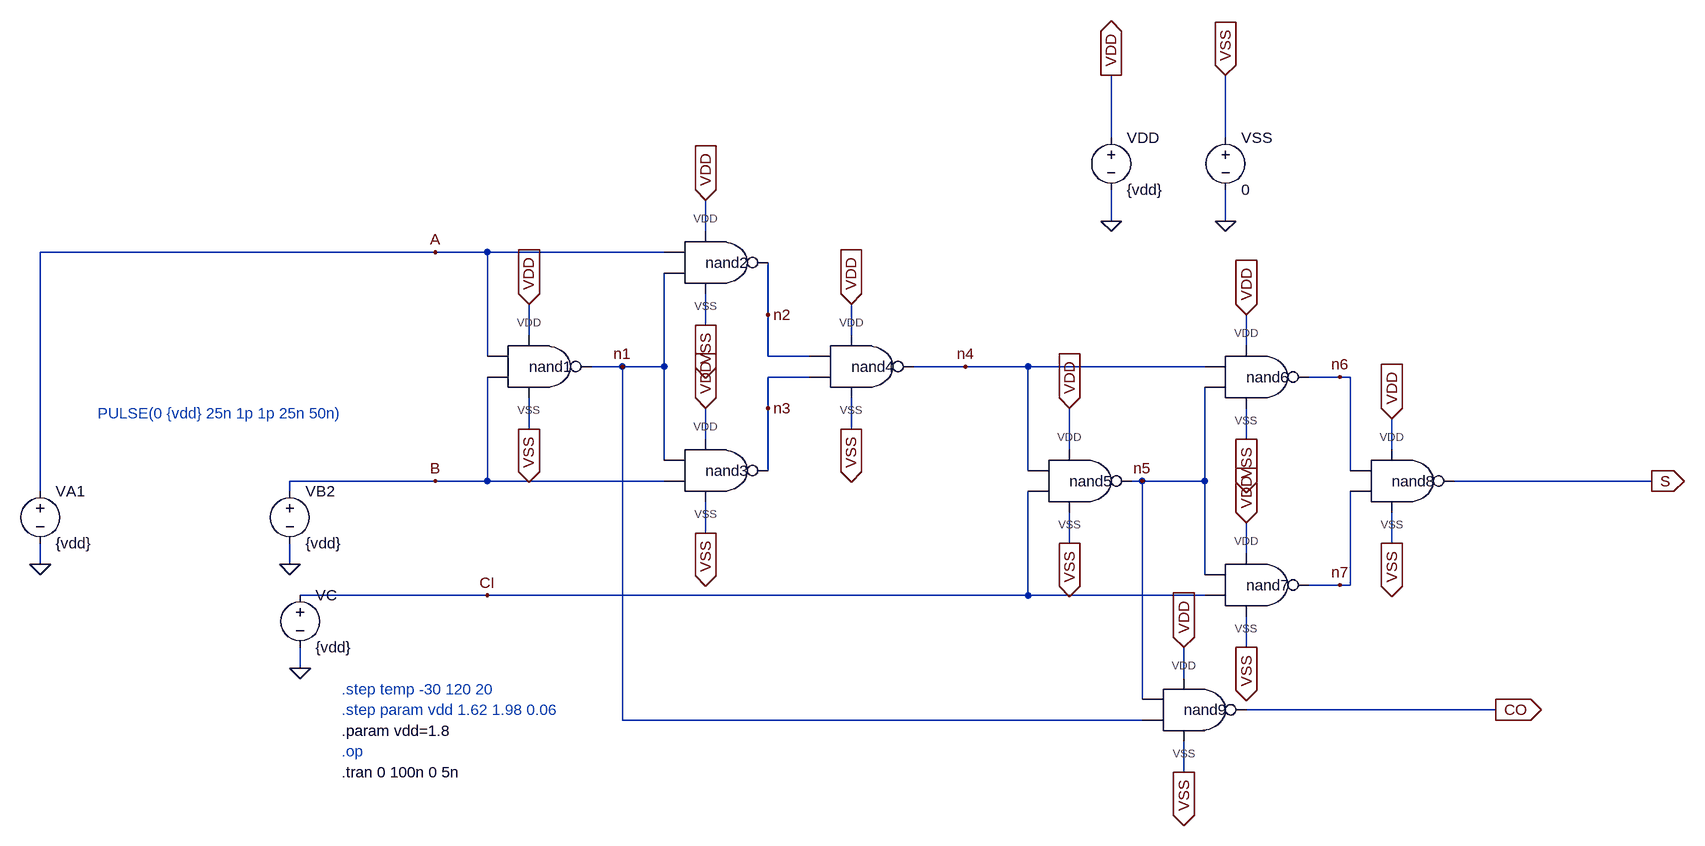
[diagram p0: schematic sumator.asc]
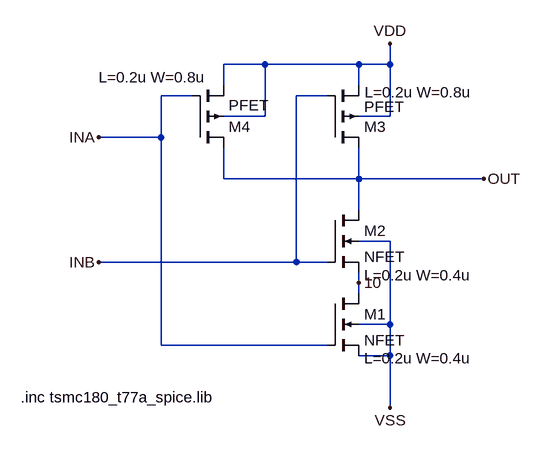
[diagram p1: sub-circuit nand.asc]
sumator.asc, the LTspice schematic file:
Version 4
SHEET 1 1644 808
WIRE 656 -272 656 -368
WIRE 832 -272 832 -368
WIRE 656 -144 656 -192
WIRE 832 -144 832 -192
WIRE 32 -128 32 -176
WIRE -384 -96 -992 -96
WIRE -304 -96 -384 -96
WIRE -32 -96 -304 -96
WIRE 128 0 128 -80
WIRE 32 16 32 -32
WIRE -240 32 -240 -16
WIRE 256 32 256 -16
WIRE 864 48 864 0
WIRE -304 64 -304 -96
WIRE 128 64 128 0
WIRE 192 64 128 64
WIRE -96 80 -144 80
WIRE -32 80 -32 -64
WIRE -32 80 -96 80
WIRE 432 80 352 80
WIRE 528 80 432 80
WIRE 800 80 528 80
WIRE 192 96 128 96
WIRE 1008 96 960 96
WIRE 1024 96 1008 96
WIRE 128 144 128 96
WIRE -240 176 -240 128
WIRE 256 176 256 128
WIRE 32 192 32 144
WIRE 864 192 864 144
WIRE 592 208 592 144
WIRE 1088 208 1088 160
WIRE -32 224 -32 80
WIRE 128 240 128 144
WIRE 528 240 528 80
WIRE 1024 240 1024 96
WIRE -384 256 -608 256
WIRE -304 256 -304 96
WIRE -304 256 -384 256
WIRE -32 256 -304 256
WIRE 704 256 688 256
WIRE 800 256 800 112
WIRE 800 256 704 256
WIRE 1488 256 1184 256
WIRE -992 272 -992 -96
WIRE -608 272 -608 256
WIRE 32 336 32 288
WIRE 592 352 592 304
WIRE 1088 352 1088 304
WIRE 864 368 864 320
WIRE -992 384 -992 352
WIRE -608 384 -608 352
WIRE 800 400 800 256
WIRE 1008 416 960 416
WIRE 1024 416 1024 272
WIRE 1024 416 1008 416
WIRE -304 432 -592 432
WIRE 528 432 528 272
WIRE 528 432 -304 432
WIRE 800 432 528 432
WIRE 864 512 864 464
WIRE -592 544 -592 512
WIRE 768 560 768 512
WIRE 704 592 704 256
WIRE 1248 608 864 608
WIRE -96 624 -96 80
WIRE 704 624 -96 624
WIRE 768 704 768 656
FLAG 1488 256 S
IOPIN 1488 256 Out
FLAG -608 384 0
FLAG -992 384 0
FLAG 656 -368 VDD
IOPIN 656 -368 Out
FLAG 32 -176 VDD
IOPIN 32 -176 In
FLAG 32 144 VDD
IOPIN 32 144 In
FLAG -240 -16 VDD
IOPIN -240 -16 In
FLAG 256 -16 VDD
IOPIN 256 -16 In
FLAG 592 144 VDD
IOPIN 592 144 In
FLAG 864 320 VDD
IOPIN 864 320 In
FLAG 1088 160 VDD
IOPIN 1088 160 In
FLAG 864 0 VDD
IOPIN 864 0 In
FLAG 768 512 VDD
IOPIN 768 512 In
FLAG 656 -144 0
FLAG -592 544 0
FLAG 1248 608 CO
IOPIN 1248 608 Out
FLAG -384 -96 A
FLAG -384 256 B
FLAG -304 432 CI
FLAG -96 80 n1
FLAG 128 0 n2
FLAG 128 144 n3
FLAG 432 80 n4
FLAG 704 256 n5
FLAG 1008 96 n6
FLAG 1008 416 n7
FLAG 832 -144 0
FLAG 832 -368 VSS
IOPIN 832 -368 In
FLAG 32 16 VSS
IOPIN 32 16 Out
FLAG -240 176 VSS
IOPIN -240 176 Out
FLAG 32 336 VSS
IOPIN 32 336 Out
FLAG 256 176 VSS
IOPIN 256 176 Out
FLAG 592 352 VSS
IOPIN 592 352 Out
FLAG 864 192 VSS
IOPIN 864 192 Out
FLAG 864 512 VSS
IOPIN 864 512 Out
FLAG 768 704 VSS
IOPIN 768 704 Out
FLAG 1088 352 VSS
IOPIN 1088 352 Out
SYMBOL NAND -240 80 R0
WINDOW 0 0 0 Left 2
SYMATTR InstName nand1
SYMBOL voltage 656 -288 R0
SYMATTR InstName VDD
SYMATTR Value {vdd}
SYMBOL voltage -608 256 R0
WINDOW 123 0 0 Left 0
WINDOW 39 0 0 Left 0
SYMATTR InstName VB2
SYMATTR Value {vdd}
SYMBOL voltage -992 256 R0
WINDOW 123 0 0 Left 0
WINDOW 39 0 0 Left 0
SYMATTR InstName VA1
SYMATTR Value {vdd}
SYMBOL NAND 32 -80 R0
WINDOW 0 0 0 Left 2
SYMATTR InstName nand2
SYMBOL NAND 32 240 R0
WINDOW 0 0 0 Left 2
SYMATTR InstName nand3
SYMBOL NAND 256 80 R0
WINDOW 0 0 0 Left 2
SYMATTR InstName nand4
SYMBOL NAND 592 256 R0
WINDOW 0 0 0 Left 2
SYMATTR InstName nand5
SYMBOL NAND 864 96 R0
WINDOW 0 0 0 Left 2
SYMATTR InstName nand6
SYMBOL NAND 864 416 R0
WINDOW 0 0 0 Left 2
SYMATTR InstName nand7
SYMBOL NAND 1088 256 R0
WINDOW 0 0 0 Left 2
SYMATTR InstName nand8
SYMBOL NAND 768 608 R0
WINDOW 0 0 0 Left 2
SYMATTR InstName nand9
SYMBOL voltage -592 416 R0
WINDOW 123 0 0 Left 0
WINDOW 39 0 0 Left 0
SYMATTR InstName VC
SYMATTR Value {vdd}
SYMBOL voltage 832 -288 R0
WINDOW 123 0 0 Left 0
WINDOW 39 0 0 Left 0
SYMATTR InstName VSS
SYMATTR Value 0
TEXT -528 672 Left 2 ;.op
TEXT -528 704 Left 2 !.tran 0 100n 0 5n
TEXT -528 640 Left 2 !.param vdd=1.8
TEXT -528 608 Left 2 ;.step param vdd 1.62 1.98 0.06
TEXT -528 576 Left 2 ;.step temp -30 120 20
TEXT -904 152 Left 2 ;PULSE(0 {vdd} 25n 1p 1p 25n 50n)

nand.asc, the sub-circuit schematic file:
Version 4
SHEET 1 880 680
WIRE 144 -208 80 -208
WIRE 288 -208 144 -208
WIRE 336 -208 336 -240
WIRE 336 -208 288 -208
WIRE 80 -176 80 -208
WIRE 288 -176 288 -208
WIRE 32 -160 -16 -160
WIRE 240 -160 192 -160
WIRE 144 -128 144 -208
WIRE 144 -128 80 -128
WIRE 336 -128 336 -208
WIRE 336 -128 288 -128
WIRE -16 -96 -16 -160
WIRE -16 -96 -112 -96
WIRE 80 -32 80 -80
WIRE 288 -32 288 -80
WIRE 288 -32 80 -32
WIRE 480 -32 288 -32
WIRE 288 16 288 -32
WIRE 336 64 288 64
WIRE 192 96 192 -160
WIRE 192 96 -112 96
WIRE 240 96 192 96
WIRE 288 128 288 112
WIRE 288 144 288 128
WIRE 336 192 336 64
WIRE 336 192 288 192
WIRE -16 224 -16 -96
WIRE 240 224 -16 224
WIRE 336 240 336 192
WIRE 336 240 288 240
WIRE 336 320 336 240
FLAG 336 -240 VDD
FLAG 480 -32 OUT
FLAG -112 -96 INA
FLAG -112 96 INB
FLAG 336 320 VSS
FLAG 288 128 10
SYMBOL nmos4 240 144 R0
WINDOW 123 56 100 Left 2
SYMATTR Value2 L=0.2u W=0.4u
SYMATTR InstName M1
SYMATTR Value NFET
SYMBOL nmos4 240 16 R0
WINDOW 123 56 100 Left 2
SYMATTR Value2 L=0.2u W=0.4u
SYMATTR InstName M2
SYMATTR Value NFET
SYMBOL pmos4 240 -80 M180
WINDOW 3 56 63 Left 2
WINDOW 123 57 85 Left 2
SYMATTR Value PFET
SYMATTR Value2 L=0.2u W=0.8u
SYMATTR InstName M3
SYMBOL pmos4 32 -80 M180
WINDOW 3 56 65 Left 2
WINDOW 123 -144 108 Left 2
SYMATTR Value PFET
SYMATTR Value2 L=0.2u W=0.8u
SYMATTR InstName M4
TEXT -232 304 Left 2 !.inc tsmc180_t77a_spice.lib

The netlist it stands for:
* sumator.asc
Xnand1 A B n1 VDD VSS nand
VDD VDD 0 {vdd}
VB2 B 0 {vdd}
VA1 A 0 {vdd}
Xnand2 A n1 n2 VDD VSS nand
Xnand3 n1 B n3 VDD VSS nand
Xnand4 n2 n3 n4 VDD VSS nand
Xnand5 n4 CI n5 VDD VSS nand
Xnand6 n4 n5 n6 VDD VSS nand
Xnand7 n5 CI n7 VDD VSS nand
Xnand8 n6 n7 S VDD VSS nand
Xnand9 n5 n1 CO VDD VSS nand
VC CI 0 {vdd}
VSS VSS 0 0

* block symbol definitions
.subckt nand INA INB OUT VDD VSS
M1 10 INA VSS VSS NFET L=0.2u W=0.4u
M2 OUT INB 10 VSS NFET L=0.2u W=0.4u
M3 OUT INB VDD VDD PFET L=0.2u W=0.8u
M4 OUT INA VDD VDD PFET L=0.2u W=0.8u
.inc tsmc180_t77a_spice.lib
.ends nand

.model NMOS NMOS
.model PMOS PMOS
.lib standard.mos
* .op
.tran 0 100n 0 5n
.param vdd=1.8
* .step param vdd 1.62 1.98 0.06
* .step temp -30 120 20
* PULSE(0 {vdd} 25n 1p 1p 25n 50n)
.backanno
.end